# Altium project Relay_Machine_REG_PCB.PrjPcb
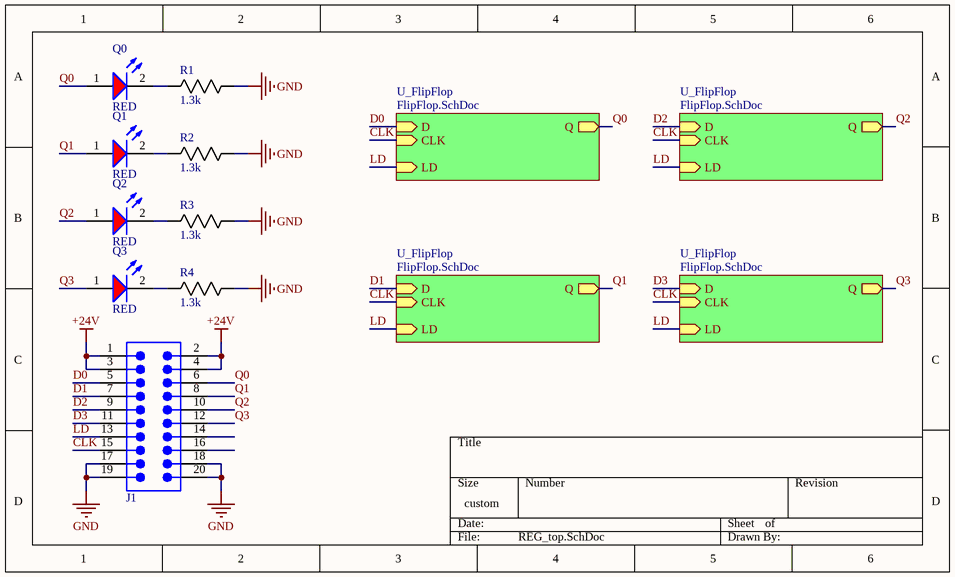
[diagram p0: REG_top.SchDoc]
2 sheets, 65 parts. Net scope: hierarchical (ports join the sheet entries above them; power ports are global).
Board file: PCB_REG.PcbDoc
Sheets:
  REG_top.SchDoc
    U_FlipFlop = FlipFlop.SchDoc
    U_FlipFlop = FlipFlop.SchDoc
    U_FlipFlop = FlipFlop.SchDoc
    U_FlipFlop = FlipFlop.SchDoc

## Sheet REG_top.SchDoc
size 177 x 106 mm; SheetNumber: 1; SheetTotal: 2

### Parts
J1  Con 2.54mm 10x2pos  [Con 2.54mm 10x2pos]  (value not drawn)
Q0  RED  [LED RED 151051RS11000]
Q1  RED  [LED RED 151051RS11000]
Q2  RED  [LED RED 151051RS11000]
Q3  RED  [LED RED 151051RS11000]
R1  1.3k  [RES 2512]
R2  1.3k  [RES 2512]
R3  1.3k  [RES 2512]
R4  1.3k  [RES 2512]

### Sub-sheets
U_FlipFlop = FlipFlop.SchDoc: Q (out), CLK (in), LD (in), D (in)
U_FlipFlop = FlipFlop.SchDoc: Q (out), CLK (in), LD (in), D (in)
U_FlipFlop = FlipFlop.SchDoc: Q (out), CLK (in), LD (in), D (in)
U_FlipFlop = FlipFlop.SchDoc: Q (out), CLK (in), LD (in), D (in)

### Nets
+24V: J1.1 J1.2 J1.3 J1.4
GND: J1.17 J1.18 J1.19 J1.20 R1.2 R2.2 R3.2 R4.2
CLK: J1.15 ; sheet U_FlipFlop/CLK, sheet U_FlipFlop/CLK, sheet U_FlipFlop/CLK, sheet U_FlipFlop/CLK
D0: J1.5 ; sheet U_FlipFlop/D
D1: J1.7 ; sheet U_FlipFlop/D
D2: J1.9 ; sheet U_FlipFlop/D
D3: J1.11 ; sheet U_FlipFlop/D
LD: J1.13 ; sheet U_FlipFlop/LD, sheet U_FlipFlop/LD, sheet U_FlipFlop/LD, sheet U_FlipFlop/LD
Q0: J1.6 Q0.1(A) ; sheet U_FlipFlop/Q  [project net L2_SRBack]
Q1: J1.8 Q1.1(A) ; sheet U_FlipFlop/Q  [project net L2_SRBack]
Q2: J1.10 Q2.1(A) ; sheet U_FlipFlop/Q  [project net L2_SRBack]
Q3: J1.12 Q3.1(A) ; sheet U_FlipFlop/Q  [project net L2_SRBack]
NetQ0_2: Q0.2(K) R1.1
NetQ1_2: Q1.2(K) R2.1
NetQ2_2: Q2.2(K) R3.1
NetQ3_2: Q3.2(K) R4.1

Not connected (* = marked no-connect by the designer): J1 14 16

### Library data of the parts
J1 = Con 2.54mm 10x2pos: WR-BHD Straight Male, Box Header, Through Hole, 2 Rows, 20 Contacts, 2.54mm Pitch; Manufacturer: Wurth Elektronik; Manufacturer Part Number: 61202021621; Connector Type: Male Pin; Contact Resistance: 20mΩ; Current Rating: 3A; Insulation: Insulated; Insulation Resistance: 1GΩ; Number of Contacts: 20; Operating Supply Voltage: 250V; Supplier: DigiKey; Supplier Part Number: 732-2096-ND; RoHS: Compliant; Category: Headers and Wire Housings; Stock: 12933; Pricing: 1=0.86, 10=0.839, 50=0.7732, 160=0.69213, 320=0.64375 (USD); Color: Black; Contact Gender: Male; Contact Material: Gold; Contact Plating: Gold; Flammability Rating: UL94 V-0; Gender: Male; Height: 9.25mm; Housing Material: PBT; Insulation Material: PBT; Lead Pitch: 2.54mm; Length: 33.06mm; Max Operating Temperature: 105°C; Min Operating Temperature: -40°C; Mounting Technology: Through Hole; Pins: 20; Number of Positions: 20; Number of Rows: 2; Orientation: Vertical; Pitch: 2.54mm; Row Spacing: 2.54mm; Termination: Through Hole; Voltage Rating: 250V; Voltage Rating (DC): 250V; Width: 33.06mm; ComponentLink1URL: https://datasheet.octopart.com:443/61202021621-W%C3%BCrth-Elektronik-datasheet-111087935.pdf?src-supplier=Upverter; ComponentLink1Description: https://datasheet.octopart.com:443/61202021621-W%C3%BCrth-Elektronik-datasheet-111087935.pdf?src-supplier=Upverter; ComponentLink2URL: https://datasheet.octopart.com:443/61202021621-Wurth-Elektronik-datasheet-168480024.pdf?src-supplier=Wurth+Elektronik; ComponentLink2Description: https://datasheet.octopart.com:443/61202021621-Wurth-Elektronik-datasheet-168480024.pdf?src-supplier=Wurth+Elektronik; ComponentLink3URL: https://datasheet.octopart.com:443/61202021621-W%C3%BCrth-Elektronik-datasheet-149523954.pdf?src-supplier=Farnell; ComponentLink3Description: https://datasheet.octopart.com:443/61202021621-W%C3%BCrth-Elektronik-datasheet-149523954.pdf?src-supplier=Farnell; ComponentLink4URL: https://datasheet.octopart.com:443/61202021621-W%C3%BCrth-Elektronik-Midcom-datasheet-10469446.pdf?src-supplier=Farnell; ComponentLink4Description: https://datasheet.octopart.com:443/61202021621-W%C3%BCrth-Elektronik-Midcom-datasheet-10469446.pdf?src-supplier=Farnell; ComponentLink5URL: https://datasheet.octopart.com:443/61202021621-W%C3%BCrth-Elektronik-Midcom-datasheet-5367532.pdf?src-supplier=element14+APAC; ComponentLink5Description: https://datasheet.octopart.com:443/61202021621-W%C3%BCrth-Elektronik-Midcom-datasheet-5367532.pdf?src-supplier=element14+APAC
Q0-Q3 = LED RED 151051RS11000: WL-TMRC Red Color Diffused 5 mm Round Through Hole LED; Manufacturer: Wurth Elektronik; Dominant Wavelength: 645nm; Forward Current: 100mA; Forward Voltage: 2.1V; Lens Size: 5mm; Lens Style: Circular, Diffused, Round; Luminous Intensity: 30mcd; Max Reverse Voltage (DC): 5V; Peak Wavelength: 650nm; Test Current: 20mA; Viewing Angle: 60°; Wavelength: 630nm; Supplier: DigiKey; Supplier Part Number: 732-5016-ND; Manufacturer Part Number: 151051RS11000; RoHS: Compliant; Category: LEDs; Stock: 19120; Pricing: 1=0.15, 50=0.1396, 100=0.1197, 500=0.105 (USD); Case/Package: Radial; Color: Red; Height: 8.6mm; Length: 5mm; Max Operating Temperature: 85°C; Min Operating Temperature: -40°C; Mounting Technology: Through Hole; Packaging: Bulk; REACH SVHC: Unknown; Width: 5mm; ComponentLink1URL: https://datasheet.octopart.com:443/151051RS11000-Wurth-Elektronik-datasheet-168474692.pdf?src-supplier=Wurth+Elektronik; ComponentLink1Description: https://datasheet.octopart.com:443/151051RS11000-Wurth-Elektronik-datasheet-168474692.pdf?src-supplier=Wurth+Elektronik; ComponentLink2URL: https://datasheet.octopart.com:443/151051RS11000-W%C3%BCrth-Elektronik-datasheet-83005830.pdf?src-supplier=Future+Electronics; ComponentLink2Description: https://datasheet.octopart.com:443/151051RS11000-W%C3%BCrth-Elektronik-datasheet-83005830.pdf?src-supplier=Future+Electronics; ComponentLink3URL: https://datasheet.octopart.com:443/151051RS11000-W%C3%BCrth-Elektronik-datasheet-15983824.pdf?src-supplier=element14+APAC; ComponentLink3Description: https://datasheet.octopart.com:443/151051RS11000-W%C3%BCrth-Elektronik-datasheet-15983824.pdf?src-supplier=element14+APAC
R1-R4 = RES 1.3k 2512 1W: Res Thick Film 2512 1.3K Ohm 1% 1W ±100ppm/C Pad SMD Automotive T/R RMCF2512FT1K30; Manufacturer: Stackpole Electronics; Value: 1.3kΩ; Temperature Coefficient: 100ppm/°C; Voltage Rating: 500V; Working Voltage: 200V; Supplier: DigiKey; Supplier Part Number: RMCF2512FT1K30CT-ND; Manufacturer Part Number: RMCF2512FT1K30; RoHS: Compliant; Category: Chip SMD Resistors; Stock: 10417; Pricing: 1=0.24, 10=0.126, 25=0.1008, 50=0.0864, 100=0.0751, 250=0.0638, 500=0.05728, 1000=0.0521 (USD); Case/Package: 2512; China RoHS: Non-Compliant; Composition: Thick Film; Contact Plating: Tin; Depth: 3.2mm; Features: Automotive AEC-Q200; Height: 550µm; Length: 6.2992mm; Lifecycle Status: Production; Max Operating Temperature: 155°C; Max Power Dissipation: 1W; Military Standard: Not; Min Operating Temperature: -55°C; Mounting Technology: Surface Mount; Number of Terminals: 2; Number of Terminations: 2; Packaging: Tape & Reel (TR); Power Dissipation: 1W; Power Rating: 1W; Radiation Hardening: No; REACH SVHC: Yes; Schedule B: 8533210045, 8533210045|8533210045|8533210045|8533210045|8533210045; Tolerance: 1%; Width: 3.2mm; ComponentLink1URL: https://datasheet.octopart.com:443/RMCF2512FT1K30-Stackpole-Electronics-datasheet-182148065.pdf?src-supplier=IHS; ComponentLink1Description: https://datasheet.octopart.com:443/RMCF2512FT1K30-Stackpole-Electronics-datasheet-182148065.pdf?src-supplier=IHS; ComponentLink2URL: https://datasheet.octopart.com:443/RMCF2512FT1K30-Stackpole-Electronics-datasheet-28504820.pdf?src-supplier=Future+Electronics; ComponentLink2Description: https://datasheet.octopart.com:443/RMCF2512FT1K30-Stackpole-Electronics-datasheet-28504820.pdf?src-supplier=Future+Electronics; ComponentLink3URL: https://datasheet.octopart.com:443/RMCF2512FT1K30-Stackpole-Electronics-datasheet-141193804.pdf?src-supplier=Master+Electronics; ComponentLink3Description: https://datasheet.octopart.com:443/RMCF2512FT1K30-Stackpole-Electronics-datasheet-141193804.pdf?src-supplier=Master+Electronics; ComponentLink4URL: https://datasheet.octopart.com:443/RMCF2512FT1K30-Stackpole-Electronics-datasheet-189104163.pdf?src-supplier=Master+Electronics; ComponentLink4Description: https://datasheet.octopart.com:443/RMCF2512FT1K30-Stackpole-Electronics-datasheet-189104163.pdf?src-supplier=Master+Electronics; ComponentLink5URL: https://datasheet.octopart.com:443/RMCF2512FT1K30-Stackpole-Electronics-datasheet-116606903.pdf?src-supplier=Master+Electronics; ComponentLink5Description: https://datasheet.octopart.com:443/RMCF2512FT1K30-Stackpole-Electronics-datasheet-116606903.pdf?src-supplier=Master+Electronics; ComponentLink6URL: https://datasheet.octopart.com:443/RMCF2512FT1K30-Stackpole-Electronics-datasheet-62091608.pdf?src-supplier=Stackpole+Electronics; ComponentLink6Description: https://datasheet.octopart.com:443/RMCF2512FT1K30-Stackpole-Electronics-datasheet-62091608.pdf?src-supplier=Stackpole+Electronics; ComponentLink7URL: https://datasheet.octopart.com:443/RMCF2512FT1K30-Stackpole-Electronics-datasheet-12534581.pdf?src-supplier=Stackpole+Electronics; ComponentLink7Description: https://datasheet.octopart.com:443/RMCF2512FT1K30-Stackpole-Electronics-datasheet-12534581.pdf?src-supplier=Stackpole+Electronics; ComponentLink8URL: https://datasheet.octopart.com:443/RMCF2512FT1K30-Stackpole-Electronics-datasheet-10788263.pdf?src-supplier=Stackpole+Electronics; ComponentLink8Description: https://datasheet.octopart.com:443/RMCF2512FT1K30-Stackpole-Electronics-datasheet-10788263.pdf?src-supplier=Stackpole+Electronics; ComponentLink9URL: http://sigma.octopart.com:80/15940719/materials_sheet/Stackpole-Electronics-RMCF2512FT1K30.pdf?src-supplier=Compliance+Statements; ComponentLink9Description: http://sigma.octopart.com:80/15940719/materials_sheet/Stackpole-Electronics-RMCF2512FT1K30.pdf?src-supplier=Compliance+Statements; ComponentLink10URL: http://sigma.octopart.com:80/141158212/rohs_statement/Stackpole-Electronics-RMCF2512FT1K30.pdf?src-supplier=Compliance+Statements; ComponentLink10Description: http://sigma.octopart.com:80/141158212/rohs_statement/Stackpole-Electronics-RMCF2512FT1K30.pdf?src-supplier=Compliance+Statements; ComponentLink11URL: http://sigma.octopart.com:80/141158211/reach_statement/Stackpole-Electronics-RMCF2512FT1K30.pdf?src-supplier=Compliance+Statements; ComponentLink11Description: http://sigma.octopart.com:80/141158211/reach_statement/Stackpole-Electronics-RMCF2512FT1K30.pdf?src-supplier=Compliance+Statements

## Sheet FlipFlop.SchDoc
size 254 x 203 mm; SheetNumber: 2; SheetTotal: 2
Used 4 times, as channels U_FlipFlop, U_FlipFlop, U_FlipFlop, U_FlipFlop. Parts and nets are listed once, with the designators drawn on the sheet.
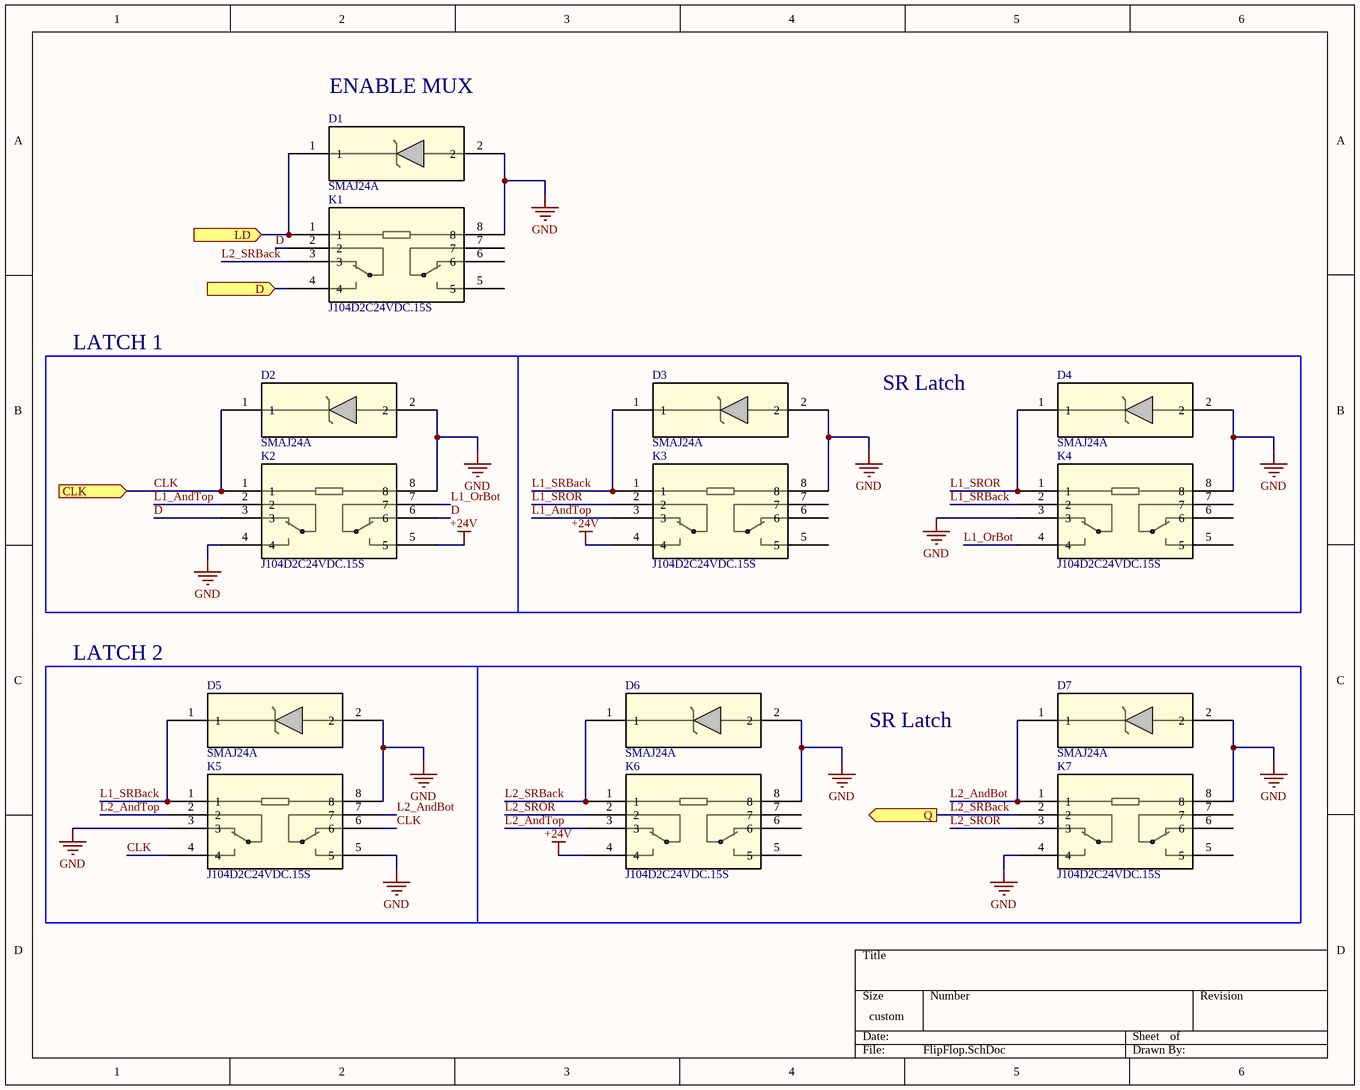
[diagram p1: FlipFlop.SchDoc]

### Parts
D1  SMAJ24A  [DI SMAJ24A]
D2  SMAJ24A  [DI SMAJ24A]
D3  SMAJ24A  [DI SMAJ24A]
D4  SMAJ24A  [DI SMAJ24A]
D5  SMAJ24A  [DI SMAJ24A]
D6  SMAJ24A  [DI SMAJ24A]
D7  SMAJ24A  [DI SMAJ24A]
K1  J104D2C24VDC.15S  [Relay J104D2C24VDC.15S]
K2  J104D2C24VDC.15S  [Relay J104D2C24VDC.15S]
K3  J104D2C24VDC.15S  [Relay J104D2C24VDC.15S]
K4  J104D2C24VDC.15S  [Relay J104D2C24VDC.15S]
K5  J104D2C24VDC.15S  [Relay J104D2C24VDC.15S]
K6  J104D2C24VDC.15S  [Relay J104D2C24VDC.15S]
K7  J104D2C24VDC.15S  [Relay J104D2C24VDC.15S]

### Ports
CLK (in, see RAM_top[3A]), D (in, see RAM_top[3A]), LD (in, see RAM_top[3B]), Q (out, see RAM_top[4A])

### Nets
+24V: K2.5 K3.4 K6.4
GND: D1.2 D2.2 D3.2 D4.2 D5.2 D6.2 D7.2 K1.8 K2.4 K2.8 K3.8 K4.3 K4.8 K5.3 K5.5 K5.8 K6.8 K7.4 K7.8
CLK: D2.1 K2.1 K5.4 K5.6 ; port CLK
D: K1.2 K2.3 K2.6
D: K1.4 ; port D  [a separate net that carries the same name]
L1_AndTop: K2.2 K3.3
L1_OrBot: K2.7 K4.4
L1_SRBack: D3.1 D5.1 K3.1 K4.2 K5.1
L1_SROR: D4.1 K3.2 K4.1
L2_AndBot: D7.1 K5.7 K7.1
L2_AndTop: K5.2 K6.3
L2_SRBack: D6.1 K1.3 K6.1 K7.2 ; port Q
L2_SROR: K6.2 K7.3
LD: D1.1 K1.1 ; port LD

Not connected (* = marked no-connect by the designer): K1 5 6 7; K3 5 6 7; K4 5 6 7; K6 5 6 7; K7 5 6 7

### Channels
U_FlipFlop: ports CLK=CLK D=D0 LD=LD Q=L2_SRBack
U_FlipFlop: designators D1=D22 D2=D23 D3=D24 D4=D25 D5=D26 D6=D27 D7=D28 K1=K22 K2=K23 K3=K24 K4=K25 K5=K26 K6=K27 K7=K28; ports CLK=CLK D=D1 LD=LD Q=L2_SRBack
U_FlipFlop: designators D1=D8 D2=D9 D3=D10 D4=D11 D5=D12 D6=D13 D7=D14 K1=K8 K2=K9 K3=K10 K4=K11 K5=K12 K6=K13 K7=K14; ports CLK=CLK D=D2 LD=LD Q=L2_SRBack
U_FlipFlop: designators D1=D15 D2=D16 D3=D17 D4=D18 D5=D19 D6=D20 D7=D21 K1=K15 K2=K16 K3=K17 K4=K18 K5=K19 K6=K20 K7=K21; ports CLK=CLK D=D3 LD=LD Q=L2_SRBack

### Notes on the sheet
- ENABLE MUX
- LATCH 1
- SR Latch
- LATCH 2

### Library data of the parts
D1-D7 = DI SMAJ24A: SMAJ Series 400 W 24 V Uni-Directional Surface Mount TVS Diode - DO-214AC; Manufacturer: Littelfuse; Breakdown Voltage: 28.1V; Value: 650pF; Clamping Voltage: 38.9V; Direction: Unidirectional; Element Configuration: Single; Forward Voltage: 3.5V; Leakage Current: 1µA; Max Breakdown Voltage: 29.5V; Max Junction Temperature (Tj): 150°C; Max Output current: 10.3A; Max Power Dissipation: 3.3W; Min Breakdown Voltage: 26.7V; Number of Channels: 1; Operating Supply Voltage: 24V; Peak Pulse Power: 400W; Power Line Protection: No; Test Current: 1mA; Supplier: DigiKey; Supplier Part Number: SMAJ24ALFCT-ND; Manufacturer Part Number: SMAJ24A; RoHS: Compliant; Category: TVS Diodes; Stock: 97583; Pricing: 1=0.21, 10=0.113, 100=0.074, 500=0.072, 1000=0.071 (USD); Case/Package: SMA; China RoHS: Non-Compliant; Composition: Zener; Height: 2.29mm; Lead Free: Lead Free; Length: 4.5mm; Lifecycle Status: Production; Max Operating Temperature: 150°C; Max Reverse Leakage Current: 1µA; Max Surge Current: 10.3A; Min Operating Temperature: -65°C; Mounting Technology: Surface Mount; Number of Elements: 1; Pins: 2; Number of Terminals: 2; Number of Unidirectional Channels: 1; Packaging: Tape & Reel; Peak Pulse Current: 10.3A; Peak Reverse Current: 1µA; Polarity: Unidirectional; Power Dissipation: 400W; Power Rating: 400W; Radiation Hardening: No; REACH SVHC: No; Reverse Breakdown Voltage: 26.7V; Reverse Standoff Voltage: 24V; Reverse Voltage: 24V; Schedule B: 8541100080, 8541100080|8541100080|8541100080|8541100080|8541100080; Termination: SMD/SMT; Voltage Rating (DC): 24V; Width: 2.79mm; ComponentLink1URL: https://datasheet.octopart.com:443/SMAJ24A-Littelfuse-datasheet-150463581.pdf?src-supplier=Farnell; ComponentLink1Description: https://datasheet.octopart.com:443/SMAJ24A-Littelfuse-datasheet-150463581.pdf?src-supplier=Farnell; ComponentLink2URL: https://datasheet.octopart.com:443/SMAJ24A-Littelfuse-datasheet-63710798.pdf?src-supplier=element14+APAC; ComponentLink2Description: https://datasheet.octopart.com:443/SMAJ24A-Littelfuse-datasheet-63710798.pdf?src-supplier=element14+APAC; ComponentLink3URL: https://datasheet.octopart.com:443/SMAJ24A-Littelfuse-datasheet-11547152.pdf?src-supplier=element14+APAC; ComponentLink3Description: https://datasheet.octopart.com:443/SMAJ24A-Littelfuse-datasheet-11547152.pdf?src-supplier=element14+APAC; ComponentLink4URL: https://datasheet.octopart.com:443/SMAJ24A-Littelfuse-datasheet-5393952.pdf?src-supplier=element14+APAC; ComponentLink4Description: https://datasheet.octopart.com:443/SMAJ24A-Littelfuse-datasheet-5393952.pdf?src-supplier=element14+APAC; ComponentLink5URL: https://datasheet.octopart.com:443/SMAJ24A-Littelfuse-datasheet-511791.pdf?src-supplier=element14+APAC; ComponentLink5Description: https://datasheet.octopart.com:443/SMAJ24A-Littelfuse-datasheet-511791.pdf?src-supplier=element14+APAC; ComponentLink6URL: https://datasheet.octopart.com:443/SMAJ24A-Littelfuse-datasheet-164649624.pdf?src-supplier=JRH+Electronics; ComponentLink6Description: https://datasheet.octopart.com:443/SMAJ24A-Littelfuse-datasheet-164649624.pdf?src-supplier=JRH+Electronics; ComponentLink7URL: https://datasheet.octopart.com:443/SMAJ24A-Littelfuse-datasheet-38878911.pdf?src-supplier=RS+(Formerly+Allied+Electronics); ComponentLink7Description: https://datasheet.octopart.com:443/SMAJ24A-Littelfuse-datasheet-38878911.pdf?src-supplier=RS+(Formerly+Allied+Electronics); ComponentLink8URL: https://datasheet.octopart.com:443/SMAJ24A-Littelfuse-datasheet-17901671.pdf?src-supplier=Future+Electronics; ComponentLink8Description: https://datasheet.octopart.com:443/SMAJ24A-Littelfuse-datasheet-17901671.pdf?src-supplier=Future+Electronics; ComponentLink9URL: https://datasheet.octopart.com:443/SMAJ24A-Littelfuse-datasheet-1053.pdf?src-supplier=DigiKey; ComponentLink9Description: https://datasheet.octopart.com:443/SMAJ24A-Littelfuse-datasheet-1053.pdf?src-supplier=DigiKey
K1-K7 = Relay J104D2C24VDC.15S: Relay Ul Gen Purp DPDT 2C 24VDC; Manufacturer: CIT Relay & Switch; Coil Current: 6mA; Coil Power: 150mW; Coil Resistance: 3.84kΩ; Coil Voltage (DC): 18V; Contact Current Rating: 2A; Contact Resistance: 50mΩ; Contact Voltage Rating (AC): 250V; Electrical Life: 100kcycles; Insulation Resistance: 100MΩ; Max Voltage Rating (DC): 100V; Release Time: 4ms; Response Time: 6ms; Supplier: DigiKey; Supplier Part Number: 2449-J104D2C24VDC.15S-ND; Manufacturer Part Number: J104D2C24VDC.15S; Category: Signal Relays; Stock: 5620; Pricing: 1=1.26, 20=1.082, 40=1.045, 60=1.02383, 100=0.998, 260=0.95115, 500=0.92036, 1000=0.88878, 5000=0.8195 (USD); Contact Plating: Gold; Height: 11.42mm; Length: 20.37mm; Max Current Rating: 2A; Max Operating Temperature: 85°C; Min Operating Temperature: -40°C; Number of Terminals: 8; Throw Configuration: DPDT

## Nets that join several sheets
+24V: REG_top (J1.1 J1.2 J1.3 J1.4), U_FlipFlop (K2.5 K3.4 K6.4), U_FlipFlop (K23.5 K24.4 K27.4), U_FlipFlop (K9.5 K10.4 K13.4), U_FlipFlop (K16.5 K17.4 K20.4)
GND: REG_top (8 pins), U_FlipFlop (19 pins), U_FlipFlop (19 pins), U_FlipFlop (19 pins), U_FlipFlop (19 pins)
CLK: REG_top (J1.15), U_FlipFlop (D2.1 K2.1 K5.4 K5.6), U_FlipFlop (D23.1 K23.1 K26.4 K26.6), U_FlipFlop (D9.1 K9.1 K12.4 K12.6), U_FlipFlop (D16.1 K16.1 K19.4 K19.6)
D0: REG_top (J1.5), U_FlipFlop (K1.4)
D1: REG_top (J1.7), U_FlipFlop (K22.4)
D2: REG_top (J1.9), U_FlipFlop (K8.4)
D3: REG_top (J1.11), U_FlipFlop (K15.4)
L2_SRBack: REG_top (J1.6 Q0.1), U_FlipFlop (D6.1 K1.3 K6.1 K7.2)
L2_SRBack: REG_top (J1.8 Q1.1), U_FlipFlop (D27.1 K22.3 K27.1 K28.2)
L2_SRBack: REG_top (J1.10 Q2.1), U_FlipFlop (D13.1 K8.3 K13.1 K14.2)
L2_SRBack: REG_top (J1.12 Q3.1), U_FlipFlop (D20.1 K15.3 K20.1 K21.2)
LD: REG_top (J1.13), U_FlipFlop (D1.1 K1.1), U_FlipFlop (D22.1 K22.1), U_FlipFlop (D8.1 K8.1), U_FlipFlop (D15.1 K15.1)